# EAGLE design spielfeld_anzeige (EAGLE 7.7.0)
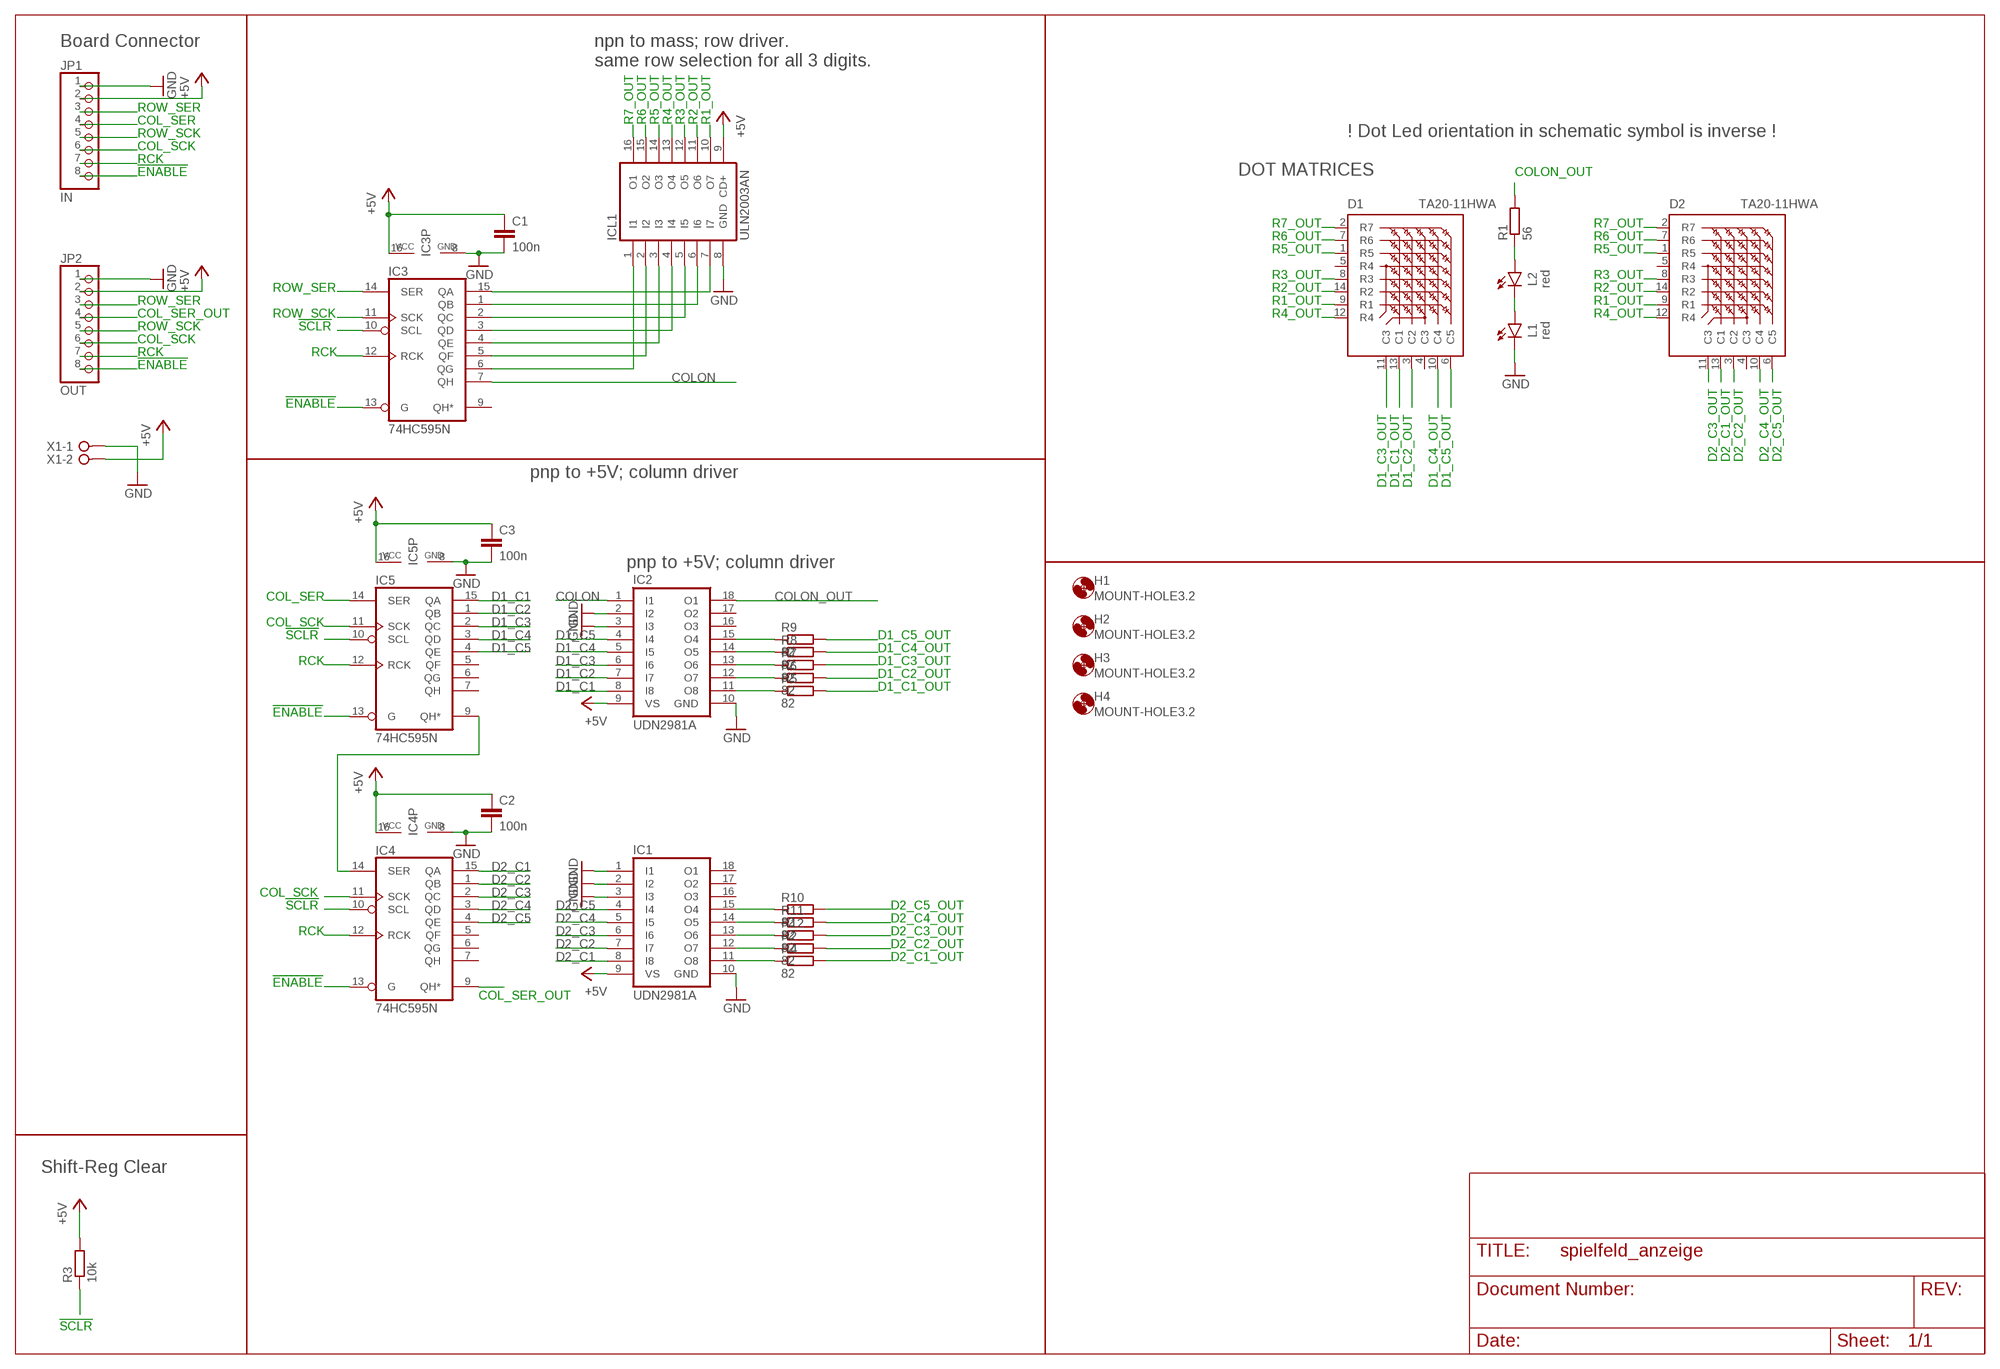
[diagram p0: schematic, sheet 1]

## Parts
C1  100n  C-EUC0805  [C0805]
C2  100n  C-EUC0805  [C0805]
C3  100n  C-EUC0805  [C0805]
D1  TA20-11HWA  [TA20-11HWA]
D2  TA20-11HWA  [TA20-11HWA]
H1  MOUNT-HOLE3.2  [3,2]
H2  MOUNT-HOLE3.2  [3,2]
H3  MOUNT-HOLE3.2  [3,2]
H4  MOUNT-HOLE3.2  [3,2]
IC1  UDN2981A  [DIL18]
IC2  UDN2981A  [DIL18]
IC3  74HC595N  [DIL16]
IC4  74HC595N  [DIL16]
IC5  74HC595N  [DIL16]
ICL1  ULN2003AN  [DIL16]
JP1  IN  PINHD-1X8  [1X08]
JP2  OUT  PINHD-1X8  [1X08]
L1  red  LED-5MM  [LED_5MM]
L2  red  LED-5MM  [LED_5MM]
R1  56  R-EU_R3216  [R3216]
R2  82  R-EU_R0805  [R0805]
R3  10k  R-EU_M3216  [M3216]
R4  82  R-EU_R0805  [R0805]
R5  82  R-EU_R0805  [R0805]
R6  82  R-EU_R0805  [R0805]
R7  82  R-EU_R0805  [R0805]
R8  82  R-EU_R0805  [R0805]
R9  82  R-EU_R0805  [R0805]
R10  82  R-EU_R0805  [R0805]
R11  82  R-EU_R0805  [R0805]
R12  82  R-EU_R0805  [R0805]
X1  W237-02P  [W237-132]

## Nets
!ENABLE!: IC3.13(G) IC4.13(G) IC5.13(G) JP1.8 JP2.8
!SCLR!: IC3.10(SCL) IC4.10(SCL) IC5.10(SCL) R3.1
+5V: C1.1 C2.1 C3.1 IC1.9(VS) IC2.9(VS) IC3.16(VCC) IC4.16(VCC) IC5.16(VCC) ICL1.9(CD+) JP1.2 JP2.2 R3.2 X1.2
COL_SCK: IC4.11(SCK) IC5.11(SCK) JP1.6 JP2.6
COL_SER: IC5.14(SER) JP1.4
COL_SER_OUT: IC4.9(QH*) JP2.4
COLON: IC2.1(I1) IC3.7(QH)
COLON_OUT: IC2.18(O1) R1.2
D1_C1: IC2.8(I8) IC5.15(QA)
D1_C1_OUT: D1.13(C1) R5.2
D1_C2: IC2.7(I7) IC5.1(QB)
D1_C2_OUT: D1.3(C2) R6.2
D1_C3: IC2.6(I6) IC5.2(QC)
D1_C3_OUT: D1.11(C3) R7.2
D1_C4: IC2.5(I5) IC5.3(QD)
D1_C4_OUT: D1.10(C4) R8.2
D1_C5: IC2.4(I4) IC5.4(QE)
D1_C5_OUT: D1.6(C5) R9.2
D2_C1: IC1.8(I8) IC4.15(QA)
D2_C1_OUT: D2.13(C1) R4.2
D2_C2: IC1.7(I7) IC4.1(QB)
D2_C2_OUT: D2.3(C2) R2.2
D2_C3: IC1.6(I6) IC4.2(QC)
D2_C3_OUT: D2.11(C3) R12.2
D2_C4: IC1.5(I5) IC4.3(QD)
D2_C4_OUT: D2.10(C4) R11.2
D2_C5: IC1.4(I4) IC4.4(QE)
D2_C5_OUT: D2.6(C5) R10.2
GND: C1.2 C2.2 C3.2 IC1.1(I1) IC1.2(I2) IC1.3(I3) IC1.10(GND) IC2.2(I2) IC2.3(I3) IC2.10(GND) IC3.8(GND) IC4.8(GND) IC5.8(GND) ICL1.8(GND) JP1.1 JP2.1 L1.K(C) X1.1
N$1: L1.A L2.K(C)
N$2: IC2.11(O8) R5.1
N$3: IC2.12(O7) R6.1
N$4: IC2.13(O6) R7.1
N$5: IC2.14(O5) R8.1
N$6: IC2.15(O4) R9.1
N$7: IC1.15(O4) R10.1
N$8: IC3.15(QA) ICL1.7(I7)
N$9: IC3.1(QB) ICL1.6(I6)
N$10: IC3.2(QC) ICL1.5(I5)
N$11: IC3.3(QD) ICL1.4(I4)
N$12: IC3.4(QE) ICL1.3(I3)
N$13: L2.A R1.1
N$14: IC1.14(O5) R11.1
N$15: IC1.13(O6) R12.1
N$16: IC1.12(O7) R2.1
N$17: IC1.11(O8) R4.1
N$18: IC3.5(QF) ICL1.2(I2)
N$20: IC4.14(SER) IC5.9(QH*)
N$21: IC3.6(QG) ICL1.1(I1)
R1_OUT: D1.9(R1) D2.9(R1) ICL1.10(O7)
R2_OUT: D1.14(R2) D2.14(R2) ICL1.11(O6)
R3_OUT: D1.8(R3) D2.8(R3) ICL1.12(O5)
R4_OUT: D1.12(R4) D2.12(R4) ICL1.13(O4)
R5_OUT: D1.1(R5) D2.1(R5) ICL1.14(O3)
R6_OUT: D1.7(R6) D2.7(R6) ICL1.15(O2)
R7_OUT: D1.2(R7) D2.2(R7) ICL1.16(O1)
RCK: IC3.12(RCK) IC4.12(RCK) IC5.12(RCK) JP1.7 JP2.7
ROW_SCK: IC3.11(SCK) JP1.5 JP2.5
ROW_SER: IC3.14(SER) JP1.3 JP2.3
Unconnected: D1.4(C3) D1.5(R4) D2.4(C3) D2.5(R4) IC1.16(O3) IC1.17(O2) IC1.18(O1) IC2.16(O3) IC2.17(O2) IC3.9(QH*) IC4.5(QF) IC4.6(QG) IC4.7(QH) IC5.5(QF) IC5.6(QG) IC5.7(QH)

## Notes on the sheet
- Board Connector
- npn to mass; row driver.
  same row selection for all 3 digits.
- ! Dot Led orientation in schematic symbol is inverse !
- DOT MATRICES
- pnp to +5V; column driver
- pnp to +5V; column driver
- Shift-Reg Clear

## Library data of the parts
C1-C3 = rcl:C-EU: CAPACITOR, European symbol
D1 D2 = display-kingbright:TA20-11HWA: 50mm (2.0 INCH) 5x7 DOT MATRIX DISPLAY Source: http://www.kingbright.com/manager/upload/pdf/TC20-11EWA(Ver1189410378.9); OC_FARNELL: unknown; OC_NEWARK: unknown
H1-H4 = holes:MOUNT-HOLE: MOUNTING HOLE with drill center marker
IC1 IC2 = uln-udn:UDN298*: DRIVER ARRAY Source: Allegro Microsystems Inc. / UDN2981-UDN2984.pdf
IC3-IC5 = 74xx-eu:74*595: 8-bit SHIFT REGISTER, output latch
ICL1 = uln-udn:ULN2003A: DRIVER ARRAY
JP1 JP2 = pinhead:PINHD-1X8: PIN HEADER
L1 L2 = robo_ag:LED: Led Reichelt: LA E67B Variante: PLCC4 560-1400mcd 2,2V; 50mA Gelb-Orange SMD Reichelt: LA E67F Variante: PLCC4_REV 560mcd 2,65V; 50mA Orange SMD
R1 R2 R4-R12 = rcl:R-EU_: RESISTOR, European symbol
R3 = resistor:R-EU_: RESISTOR, European symbol
X1 = con-wago-508:W237-02P: WAGO SREW CLAMP; OC_FARNELL: unknown; OC_NEWARK: unknown

## Net classes
0 default: width 0.406 mm, drill 0.5 mm, clearance 0.254 mm
1 GND: width 0.61 mm, drill 0.5 mm, clearance 0.254 mm

## Board
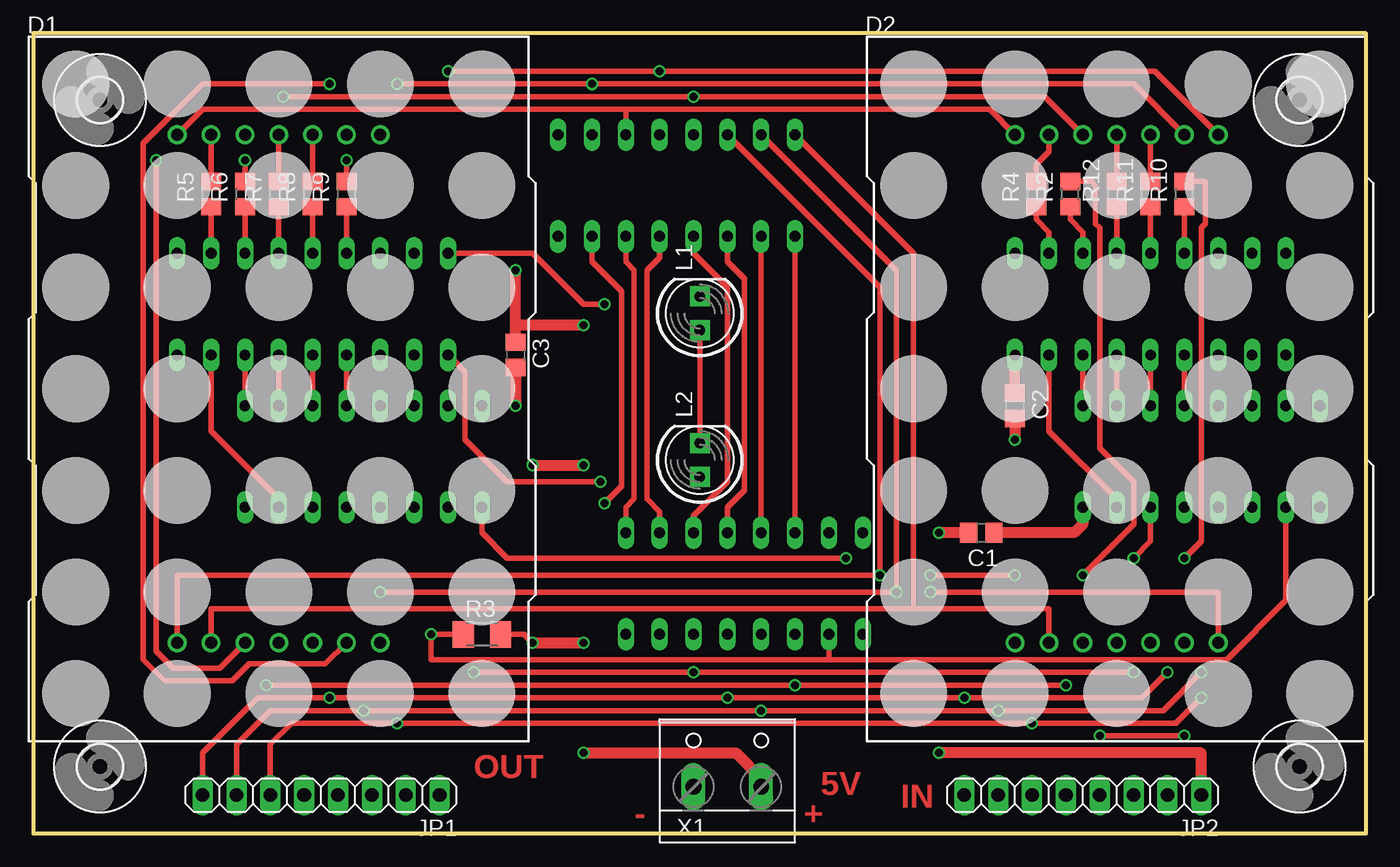
[diagram p1: board, top side]
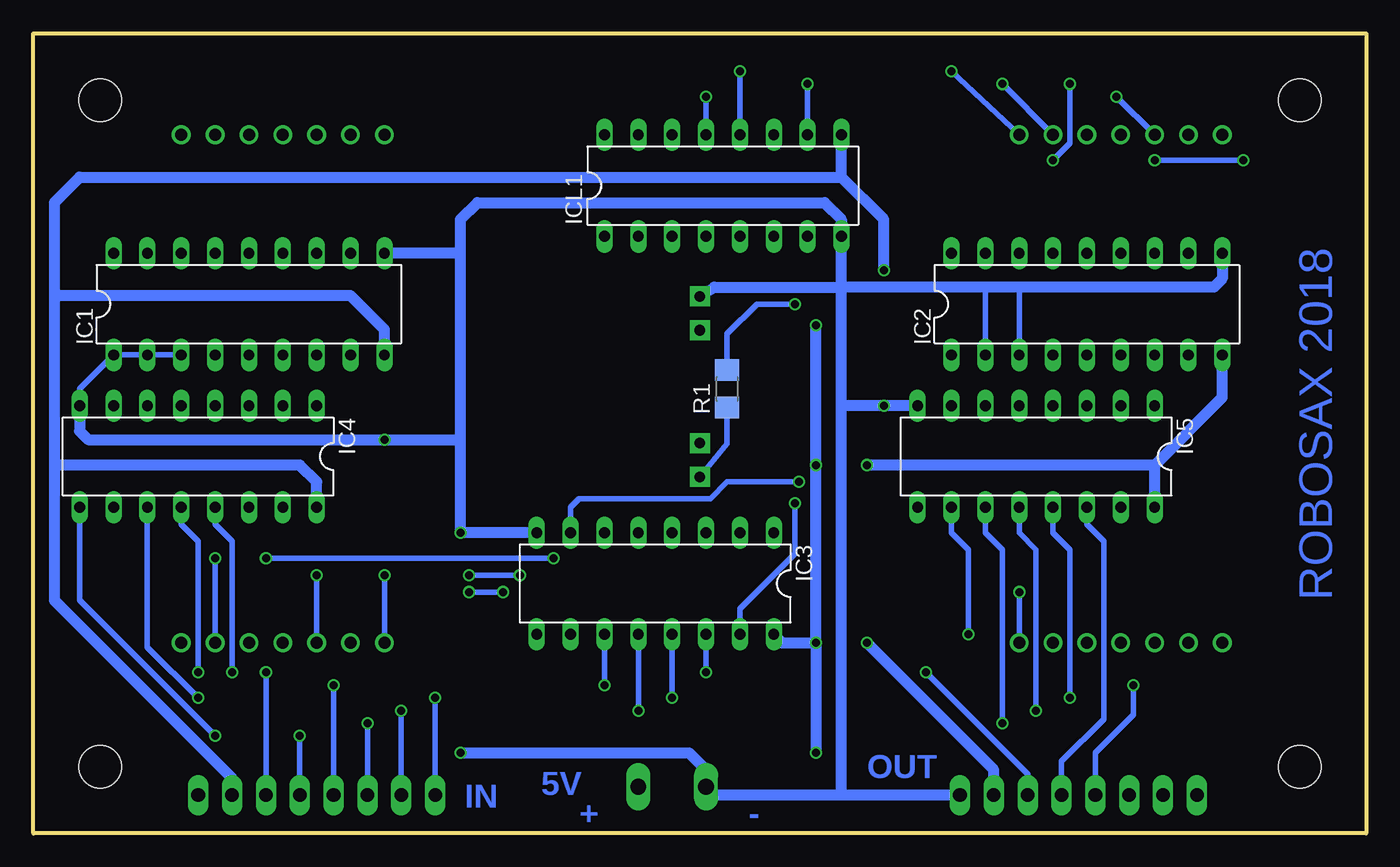
[diagram p2: board, bottom side, seen from below]

Size 100 x 60 mm. Coordinates in mm from the lower left corner, seen from the top.
Outline: 0,0 100,0 100,60 0,60 0,0
Copper layers (1*16): Top 0.035mm / dielectric 1.6mm / Bottom 0.035mm
Design rules "Elecrow_2-layer_PCB_eagle_rule": minimum track width 6mil, minimum drill 12mil, track to track 6mil, track to pad 6mil, pad to pad 6mil, via to via 8mil, smd to smd 0mil, copper to edge 20mil, drill to drill 10mil, minimum pad ring 6mil, minimum via ring 6mil, stop-mask expansion 0mil, vias tented up to drill 100mil, thermal gap 10mil

### Footprints (pad centres in the part's own frame; a part is rotated, then mirrored left to right if it is on the bottom)
C0805 = smd 1.3 x 1.5: 1 -0.95,0; 2 0.95,0
TA20-11HWA = drill 0.9 pad 1.4: 1 -7.62,-19.05; 2 -5.08,-19.05; 3 -2.54,-19.05; 4 0,-19.05; 5 2.54,-19.05; 6 5.08,-19.05; 7 7.62,-19.05; 8 7.62,19.05; 9 5.08,19.05; 10 2.54,19.05; 11 0,19.05; 12 -2.54,19.05; 13 -5.08,19.05; 14 -7.62,19.05
3,2 = hole 3.2: 0,0
DIL18 = drill 0.813 long: 1 -10.16,-3.81; 2 -7.62,-3.81; 3 -5.08,-3.81; 4 -2.54,-3.81; 5 0,-3.81; 6 2.54,-3.81; 7 5.08,-3.81; 8 7.62,-3.81; 9 10.16,-3.81; 10 10.16,3.81; 11 7.62,3.81; 12 5.08,3.81; 13 2.54,3.81; 14 0,3.81; 15 -2.54,3.81; 16 -5.08,3.81; 17 -7.62,3.81; 18 -10.16,3.81
DIL16 = drill 0.813 long: 1 -8.89,-3.81; 2 -6.35,-3.81; 3 -3.81,-3.81; 4 -1.27,-3.81; 5 1.27,-3.81; 6 3.81,-3.81; 7 6.35,-3.81; 8 8.89,-3.81; 9 8.89,3.81; 10 6.35,3.81; 11 3.81,3.81; 12 1.27,3.81; 13 -1.27,3.81; 14 -3.81,3.81; 15 -6.35,3.81; 16 -8.89,3.81
1X08 = drill 1.016 long: 1 -8.89,0; 2 -6.35,0; 3 -3.81,0; 4 -1.27,0; 5 1.27,0; 6 3.81,0; 7 6.35,0; 8 8.89,0
LED_5MM = drill 0.8 pad 1.5 square: A -1.27,0; K 1.27,0
R3216 = smd 1.6 x 1.8: 1 -1.4,0; 2 1.4,0
R0805 = smd 1.3 x 1.5: 1 -0.95,0; 2 0.95,0
M3216 = smd 1.6 x 2: 1 -1.4,0; 2 1.4,0
W237-132 = drill 1.194 long: 1 -2.54,-0.635; 2 2.54,-0.635

### Placement (x,y rotation side)
C1  71.12,22.55 180 top
C2  73.66,32.07 270 top
C3  36.2,35.88 270 top
D1  18.41,33.34 0 top
D2  81.28,33.34 0 top
H1  5,55 0 top
H2  95,55 0 top
H3  5,5 0 top
H4  95,5 0 top
IC1  83.82,39.69 0 bottom
IC2  20.95,39.69 0 bottom
IC3  53.34,18.73 180 bottom
IC4  87.63,28.26 180 bottom
IC5  24.77,28.26 180 bottom
ICL1  48.26,48.58 0 bottom
JP1  21.59,2.86 180 top
JP2  78.74,2.86 180 top
L1  50,39 90 top
L2  50,28 90 top
R1  47.94,33.34 90 bottom
R2  77.79,47.94 90 top
R3  33.66,14.92 0 top
R4  75.25,47.94 90 top
R5  13.34,47.94 90 top
R6  15.88,47.94 90 top
R7  18.41,47.94 90 top
R8  20.95,47.94 90 top
R9  23.5,47.94 90 top
R10  86.36,47.94 90 top
R11  83.82,47.94 90 top
R12  81.28,47.94 90 top
X1  52.07,4.13 0 top

### Tracks (layer width: path | path; a pad name or v marks a point on that pad's centre or on a via)
!ENABLE!  (via drill 0.6 pad 0.41)
  Top 0.406: JP1.8 12.7,6.04 16.83,10.16 v22.23,10.16 v52.07,10.16 v69.85,10.16 83.19,10.16 v85.09,12.07
  Bottom 0.406: v69.85,10.16 JP2.8 | v85.09,12.07 85.09,21.91 86.36,23.18 IC4.13 | IC5.13 23.5,22.55 22.23,21.27 v22.23,10.16 | IC3.13 v52.07,10.16
!SCLR!  (via drill 0.6 pad 0.81)
  Top 0.406: R3.1 v29.84,14.92 29.84,13.02 59.69,13.02 | 59.69,13.02 89.53,13.02 93.98,17.47 IC4.10 | IC3.10 59.69,13.02
  Bottom 0.406: IC5.10 31.11,22.55 29.84,21.27 v29.84,14.92
+5V  (via drill 0.6 pad 0.81)
  Top 0.406: R3.2 36.83,14.92 v37.47,14.29
  Top 0.813: v41.27,6.04 52.7,6.04 54.61,4.13 X1.2 | v37.47,14.29 v41.27,14.29 | v41.27,38.1 36.2,38.1 | 36.2,38.1 v36.2,42.23 | C3.1 36.2,38.1 | C2.1 IC1.9 | IC4.16 78.74,23.18 78.11,22.55 C1.1 | v37.47,27.62 v41.27,27.62
  Bottom 0.813: JP1.2 27.94,4.77 v37.47,14.29 | IC3.16 43.81,14.29 v41.27,14.29 | v41.27,14.29 v41.27,6.04 | v41.27,14.29 v41.27,27.62 v41.27,38.1 | v36.2,42.23 36.2,46.04 39.37,49.22 | 39.37,49.22 ICL1.9 | IC1.9 73.66,37.78 76.2,40.33 98.42,40.33 | 39.37,49.22 96.52,49.22 98.42,47.31 98.42,40.33 | IC4.16 78.74,26.35 80.01,27.62 98.42,27.62 | IC5.16 15.88,27.62 | 15.88,27.62 v37.47,27.62 | 98.42,40.33 98.42,27.62 | 98.42,27.62 98.42,17.47 85.09,4.13 JP2.2 | 15.88,27.62 10.79,32.7 IC2.9
COL_SCK  (via drill 0.6 pad 0.41)
  Top 0.406: JP1.6 17.78,6.67 19.37,8.26 v27.3,8.26 v74.93,8.26 85.72,8.26 v87.63,10.16
  Bottom 0.406: v74.93,8.26 JP2.6 | 91.44,23.18 IC4.11 91.44,13.97 v87.63,10.16 | IC5.11 28.57,22.55 27.3,21.27 v27.3,8.26
COL_SER
  Bottom 0.406: IC5.14 20.95,23.18 19.68,21.91 19.68,8.57 22.86,5.4 JP1.4
COL_SER_OUT  (via drill 0.6 pad 0.81)
  Top 0.406: v86.36,7.3 v80.01,7.3
  Bottom 0.406: IC4.9 96.52,17.47 v86.36,7.3 | v80.01,7.3 JP2.4
COLON  (via drill 0.6 pad 0.81)
  Top 0.406: IC2.1 32.38,34.61 32.38,29.53 35.56,26.35 v42.55,26.35
  Bottom 0.406: IC3.7 59.69,24.45 59.05,25.09 49.21,25.09 47.94,26.35 v42.55,26.35
COLON_OUT  (via drill 0.6 pad 0.81)
  Top 0.406: IC2.18 37.47,43.5 41.27,39.69 v42.86,39.69
  Bottom 0.406: v42.86,39.69 45.72,39.69 47.94,37.47 R1.2
D1_C1
  Top 0.406: IC2.8 13.34,30.16 18.41,25.09 IC5.15
D1_C1_OUT
  Top 0.406: R5.2 D1.13
D1_C2
  Top 0.406: IC5.1 IC2.7
D1_C2_OUT  (via drill 0.6 pad 0.81)
  Top 0.406: D1.3 13.97,12.38 10.48,12.38 9.21,13.66 v9.21,50.48 | v15.88,50.48 R6.2
  Bottom 0.406: v9.21,50.48 v15.88,50.48
D1_C3
  Top 0.406: IC5.2 IC2.6
D1_C3_OUT
  Top 0.406: R7.2 D1.11
D1_C4
  Top 0.406: IC5.3 IC2.5
D1_C4_OUT
  Top 0.406: R8.2 D1.10
D1_C5
  Top 0.406: IC5.4 IC2.4
D1_C5_OUT  (via drill 0.6 pad 0.81)
  Top 0.406: R9.2 v23.5,50.48 | v22.23,56.2 12.7,56.2 8.26,51.75 8.26,13.02 9.84,11.43 14.92,11.43 16.19,12.7 21.91,12.7 D1.6
  Bottom 0.406: v23.5,50.48 22.23,51.75 v22.23,56.2
D2_C1
  Top 0.406: IC1.8 76.2,30.16 81.28,25.09 IC4.15
D2_C1_OUT
  Top 0.406: R4.2 75.25,50.17 76.2,51.12 D2.13
D2_C2
  Top 0.406: IC4.1 IC1.7
D2_C2_OUT  (via drill 0.6 pad 0.81)
  Top 0.406: v78.74,19.37 82.55,23.18 82.55,26.35 80.01,28.9 80.01,45.41 79.69,45.72 79.69,48.58 79.38,48.9 R2.2
  Bottom 0.406: v78.74,19.37 D2.3
D2_C3
  Top 0.406: IC4.2 IC1.6
D2_C3_OUT
  Top 0.406: 81.2,48.89 R12.2 D2.11
D2_C4
  Top 0.406: IC4.3 IC1.5
D2_C4_OUT
  Top 0.406: 83.74,48.89 R11.2 D2.10
D2_C5
  Top 0.406: IC4.4 IC1.4
D2_C5_OUT  (via drill 0.6 pad 0.81)
  Top 0.406: R10.2 86.68,48.89 86.68,48.9 87.95,48.9 87.95,45.72 87.63,45.41 87.63,21.91 v86.36,20.64
  Bottom 0.406: v86.36,20.64 D2.6
GND  (via drill 0.6 pad 0.81)
  Top 0.813: C3.2 v36.2,32.07 | JP2.1 87.63,6.04 v67.94,6.04 | C2.2 v73.66,29.53 | C1.2 v67.94,22.55
  Bottom 0.406: IC5.8 33.66,32.7 | IC4.8 96.52,33.34 IC1.1 IC1.2 IC1.3 | IC2.3 26.04,40.64 25.72,40.96 | IC2.2 28.57,40.64 28.89,40.96
  Bottom 0.813: IC2.10 10.79,41.59 11.43,40.96 25.72,40.96 28.89,40.96 39.37,40.96 | 39.37,40.96 ICL1.8 39.37,46.04 40.64,47.31 66.67,47.31 67.94,46.04 67.94,43.5 | L1.K 48.9,40.96 39.37,40.96 | IC5.8 v36.2,32.07 39.37,32.07 | 39.37,32.07 39.37,40.96 | JP1.1 39.37,2.86 | 39.37,2.86 39.37,32.07 | 39.37,2.86 49.53,2.86 X1.1 49.53,4.77 50.8,6.04 v67.94,6.04 | IC3.8 v67.94,22.55 67.94,29.53 | 67.94,29.53 67.94,43.5 | 67.94,43.5 IC1.10 | IC4.8 96.52,30.16 95.89,29.53 v73.66,29.53 67.94,29.53
N$1
  Top 0.406: L1.A L2.K
N$2
  Top 0.406: IC2.11 R5.1
N$3
  Top 0.406: IC2.12 R6.1
N$4
  Top 0.406: IC2.13 R7.1
N$5
  Top 0.406: IC2.14 R8.1
N$6
  Top 0.406: IC2.15 R9.1
N$7
  Top 0.406: IC1.15 R10.1
N$8  (via drill 0.6 pad 0.81)
  Top 0.406: ICL1.7 41.91,42.87 44.13,40.64 44.13,26.04 v42.86,24.77
  Bottom 0.406: IC3.15 46.99,16.83 42.86,20.96 v42.86,24.77
N$9
  Top 0.406: ICL1.6 44.45,42.87 45.09,42.23 45.09,25.09 44.45,24.45 IC3.1
N$10
  Top 0.406: ICL1.5 46.99,43.18 46.04,42.23 46.04,25.09 46.99,24.13 IC3.2
N$11
  Top 0.406: ICL1.4 49.53,43.5 52.07,40.96 52.07,26.35 49.53,23.81 IC3.3
N$12
  Top 0.406: IC3.4 52.07,24.45 53.34,25.72 53.34,41.59 52.07,42.87 ICL1.3
N$13
  Bottom 0.406: R1.1 47.94,29.21 L2.A
N$14
  Top 0.406: IC1.14 R11.1
N$15
  Top 0.406: IC1.13 R12.1
N$16
  Top 0.406: IC1.12 78.74,45.09 77.79,46.04 R2.1
N$17
  Top 0.406: IC1.11 76.2,45.09 75.25,46.04 R4.1
N$18
  Top 0.406: IC3.5 ICL1.2
N$20  (via drill 0.6 pad 0.81)
  Top 0.406: v82.55,20.64 83.82,21.91 IC4.14 | v60.96,20.64 35.56,20.64 33.66,22.55 IC5.9
  Bottom 0.406: v60.96,20.64 v82.55,20.64
N$21
  Top 0.406: IC3.6 ICL1.1
R1_OUT  (via drill 0.6 pad 0.81)
  Top 0.406: v27.3,56.2 v41.91,56.2 82.55,56.2 D2.9
  Bottom 0.406: D1.9 v27.3,56.2 | v41.91,56.2 ICL1.10
R2_OUT
  Top 0.406: D1.14 12.7,54.3 44.45,54.3 | 44.45,54.3 ICL1.11 | D2.14 71.75,54.3 44.45,54.3
R3_OUT  (via drill 0.6 pad 0.81)
  Top 0.406: v31.11,57.15 v46.99,57.15 84.14,57.15 D2.8
  Bottom 0.406: D1.8 v31.11,57.15 | v46.99,57.15 ICL1.12
R4_OUT  (via drill 0.6 pad 0.81)
  Top 0.406: D2.12 75.88,55.25 v49.53,55.25 v18.73,55.25
  Bottom 0.406: v49.53,55.25 ICL1.13 | v18.73,55.25 D1.12
R5_OUT  (via drill 0.6 pad 0.81)
  Top 0.406: ICL1.14 63.5,40.96 v63.5,19.37 10.79,19.37 D1.1 | v67.31,19.37 v73.66,19.37
  Bottom 0.406: v63.5,19.37 v67.31,19.37 | v73.66,19.37 D2.1
R6_OUT  (via drill 0.6 pad 0.81)
  Top 0.406: ICL1.15 64.77,42.23 v64.77,18.1 v26.04,18.1 | v67.31,18.1 88.9,18.1 D2.7
  Bottom 0.406: v64.77,18.1 v67.31,18.1 | v26.04,18.1 D1.7
R7_OUT
  Top 0.406: ICL1.16 66.04,43.5 66.04,16.83 | 66.04,16.83 13.34,16.83 D1.2 | D2.2 76.2,16.83 66.04,16.83
RCK  (via drill 0.6 pad 0.41)
  Top 0.406: JP1.7 15.24,6.67 17.78,9.21 v24.77,9.21 v54.61,9.21 v72.39,9.21 84.77,9.21 v87.63,12.07
  Bottom 0.406: v72.39,9.21 JP2.7 | IC3.12 v54.61,9.21 | v87.63,12.07 87.63,21.91 88.9,23.18 IC4.12 | IC5.12 26.04,22.55 24.77,21.27 v24.77,9.21
ROW_SCK  (via drill 0.6 pad 0.41, 0.6 pad 0.81)
  Top 0.406: v77.47,11.11 v57.15,11.11 v17.46,11.11
  Bottom 0.406: v77.47,11.11 JP2.5 | v17.46,11.11 17.46,8.89 20.32,6.04 JP1.5 | IC3.11 v57.15,11.11
ROW_SER  (via drill 0.6 pad 0.81)
  Top 0.406: v82.55,12.07 v49.53,12.07 v33.02,12.07
  Bottom 0.406: v49.53,12.07 IC3.14 | JP2.3 v82.55,12.07 | v33.02,12.07 25.4,4.45 JP1.3

### Text on the board
Top: OUT | 5V | IN | - | +
Bottom: ROBOSAX 2018 | OUT | 5V | IN | - | +